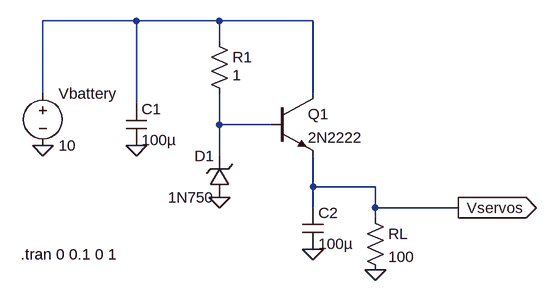
[diagram p0: schematic PSUTrial1.asc]
PSUTrial1.asc, the LTspice schematic file:
Version 4
SHEET 1 880 680
WIRE 80 0 -64 0
WIRE 208 0 80 0
WIRE 352 0 208 0
WIRE 208 32 208 0
WIRE -64 112 -64 0
WIRE 352 112 352 0
WIRE 80 128 80 0
WIRE 208 160 208 112
WIRE 288 160 208 160
WIRE 208 208 208 160
WIRE 352 256 352 208
WIRE 448 256 352 256
WIRE 352 288 352 256
WIRE 448 288 448 256
WIRE 576 288 448 288
WIRE 448 304 448 288
FLAG 208 272 0
FLAG 80 192 0
FLAG -64 192 0
FLAG 448 384 0
FLAG 576 288 Vservos
IOPIN 576 288 Out
FLAG 352 352 0
SYMBOL voltage -64 96 R0
WINDOW 123 0 0 Left 0
WINDOW 39 0 0 Left 0
SYMATTR InstName Vbattery
SYMATTR Value 10
SYMBOL zener 224 272 R180
WINDOW 0 24 64 Left 2
WINDOW 3 24 0 Left 2
SYMATTR InstName D1
SYMATTR Value 1N750
SYMBOL res 192 16 R0
WINDOW 3 36 68 Left 2
SYMATTR InstName R1
SYMATTR Value 1
SYMATTR SpiceLine tol=5
SYMBOL cap 64 128 R0
SYMATTR InstName C1
SYMATTR Value 100µ
SYMBOL npn 288 112 R0
SYMATTR InstName Q1
SYMATTR Value 2N2222
SYMBOL res 432 288 R0
SYMATTR InstName RL
SYMATTR Value 100
SYMATTR SpiceLine tol=5
SYMBOL cap 336 288 R0
SYMATTR InstName C2
SYMATTR Value 100µ
TEXT -98 360 Left 2 !.tran 0 0.1 0 1

The netlist it stands for:
* PSUTrial1.asc
Vbattery N001 0 10
D1 0 N002 1N750
R1 N001 N002 1 tol=5
C1 N001 0 100µ
Q1 N001 N002 Vservos 0 2N2222
RL Vservos 0 100 tol=5
C2 Vservos 0 100µ
.model D D
.lib standard.dio
.model NPN NPN
.model PNP PNP
.lib standard.bjt
.tran 0 0.1 0 1
.backanno
.end